# EAGLE schematic 328schema (EAGLE 7.5.0)
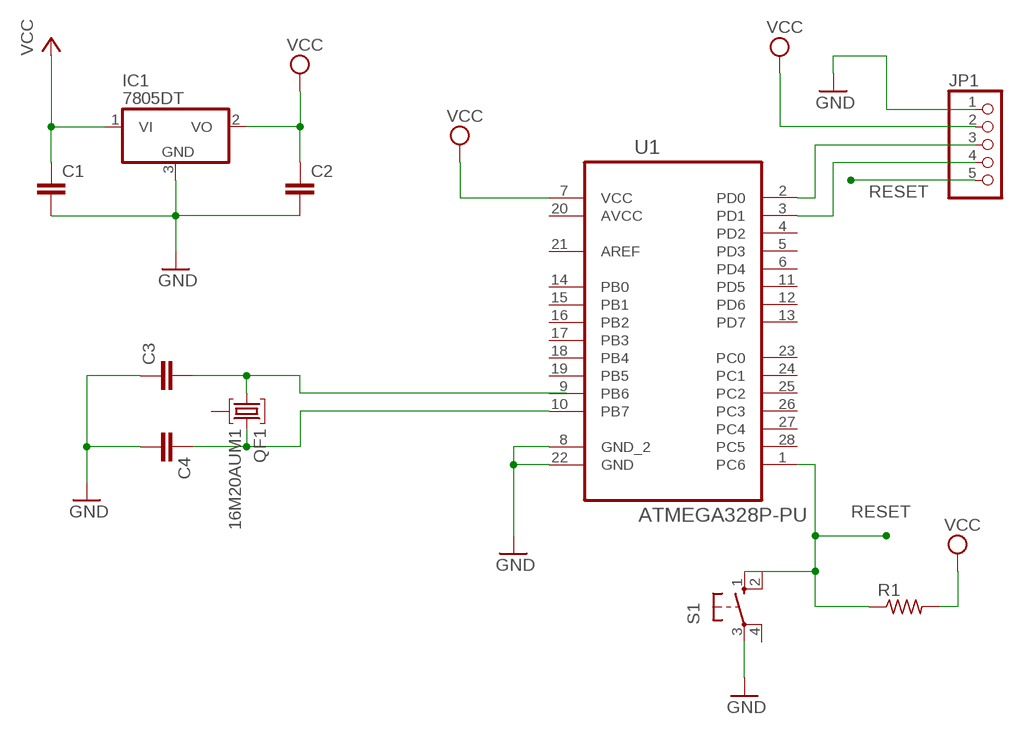
[diagram p0: schematic, sheet 1]

## Parts
C1  C-EU025-025X050  [C025-025X050]
C2  C-EU025-025X050  [C025-025X050]
C3  C-EU025-025X050  [C025-025X050]
C4  C-EU025-025X050  [C025-025X050]
IC1  7805DT  [TO252]
JP1  PINHD-1X5  [1X05]
QF1  16M20AUM1  [UM1]
R1  R-US_0207/10  [0207/10]
S1  10-XX  [B3F-10XX]
U1  ATMEGA328P-PU  [DIP254P762X457-28]

## Nets
GND: C1.2 C2.2 C3.1 C4.2 IC1.3(GND) JP1.1 S1.3(P) U1.8(GND_2) U1.22(GND)
N$1: C3.2 QF1.1
N$2: C4.1 QF1.3 U1.10(PB7)
N$3: JP1.3 U1.2(PD0)
N$5: JP1.4 U1.3(PD1)
RESET: JP1.5 R1.1 S1.1(S) U1.1(PC6)
VCC: C1.1 C2.1 IC1.1(VI) IC1.2(VO) JP1.2 R1.2 U1.7(VCC)
Unconnected: QF1.2 S1.2(S1) S1.4(P1) U1.4(PD2) U1.5(PD3) U1.6(PD4) U1.9(PB6) U1.11(PD5) U1.12(PD6) U1.13(PD7) U1.14(PB0) U1.15(PB1) U1.16(PB2) U1.17(PB3) U1.18(PB4) U1.19(PB5) U1.21(AREF) U1.23(PC0) U1.24(PC1) U1.25(PC2) U1.26(PC3) U1.27(PC4) U1.28(PC5)

## Power pins joined to a net without a drawn wire
AVCC: U1.20(AVCC)

## Library data of the parts
C1-C4 = resistor:C-EU: CAPACITOR, European symbol
IC1 = linear:78*: Positive VOLTAGE REGULATOR Source: http://cache.national.com/ds/LM/LM78L05.pdf http://www.fairchildsemi.com/ds/LM/LM7805.pdf
JP1 = pinhead:PINHD-1X5: PIN HEADER
QF1 = crystal:16M20AUM1: Monolithic Crystal Filters Source: www.vanlong.com; OC_FARNELL: unknown; OC_NEWARK: unknown
R1 = resistor:R-US_: RESISTOR, American symbol
S1 = switch-omron:10-XX: OMRON SWITCH; MPN: B3F-1000; OC_FARNELL: 176432; OC_NEWARK: 36M3542
U1 = Atmel_By_element14_Batch_1-00:ATMEGA328P-PU: 8-bit Microcontroller with In-System Programmable Flash; MPN: ATMEGA328P-PU; OC_FARNELL: 1715487; OC_NEWARK: 15R0268; PACKAGE: PDIP-28; SUPPLIER: Atmel